# Altium schematic sheet behind_v1.0.SchDoc
size A4
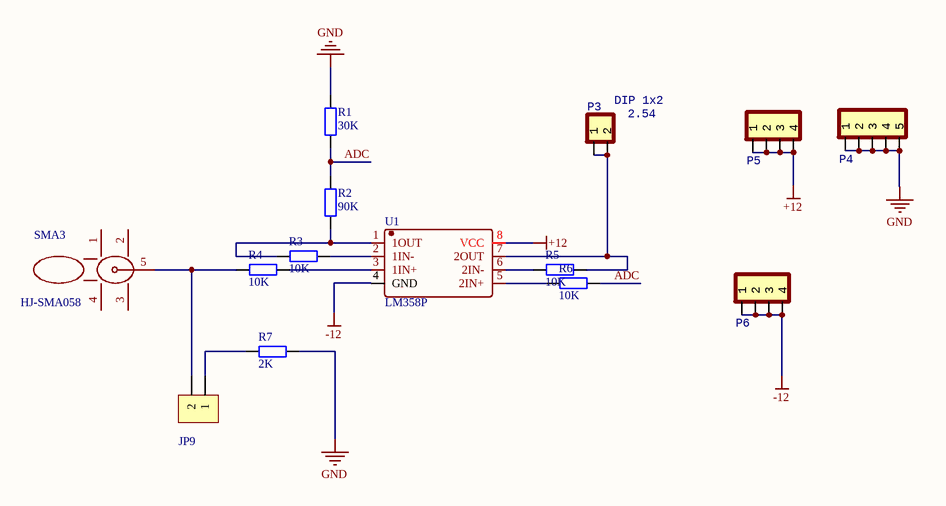
[diagram p0: behind_v1.0.SchDoc]

## Parts
JP9  HDR-1X2  [KF301-5.0-2P]  (value not drawn)
P3  value 2.54  [HDR1X2_2.54_180]  (hidden comment: DIP 1x2)
P4  HDR1x5_2.54  [HDR1X5_2.54_180]  (value not drawn)
P5  HDR1x4_2.54  [HDR1x4_2.54_180]  (value not drawn)
P6  HDR1x4_2.54  [HDR1x4_2.54_180]  (value not drawn)
R1  30K  [RS 1/4W]
R2  90K  [RS 1/4W]
R3  10K  [RS 1/4W]
R4  10K  [RS 1/4W]
R5  10K  [RS 1/4W]
R6  10K  [RS 1/4W]
R7  2K  [RS 1/4W]
SMA3  HJ-SMA058  [HJ-SMA058]
U1  LM358P  [LM358P]

## Nets
+12: P5.1 P5.2 P5.3 P5.4 U1.8(VCC)
-12: P6.1 P6.2 P6.3 P6.4 U1.4(GND)
GND: P4.1 P4.2 P4.3 P4.4 P4.5 R1.2 R7.2
ADC: R1.1 R2.2 R6.2
NetJP9_1: JP9.1 R7.1
NetJP9_2: JP9.2 R4.1 SMA3.5
NetP3_1: P3.1 P3.2 R5.2 U1.7(2OUT)
NetR2_1: R2.1 R3.1 U1.1(1OUT)
NetR3_2: R3.2 U1.2(1IN-)
NetR4_2: R4.2 U1.3(1IN+)
NetR5_1: R5.1 U1.6(2IN-)
NetR6_1: R6.1 U1.5(2IN+)

Not connected (* = marked no-connect by the designer): SMA3 1 2 3 4

## Library data of the parts
JP9 = Header 2: 2P接插件; 版权归属: 源创客; BOM名称: 2P接插件; 学习资源: www.ooocke.com
P3 = HDR1x2_2.54: Header; Type: DIP 1x2
P4 = HDR1x5_2.54: Header
P5 P6 = HDR1x4_2.54: Header
R1-R7 = R-CRR: 直插色环电阻; BOM名称: 色环电阻; 版权归属: 源创客; 学习资源: www.ooocke.com